# EAGLE design fanCtrl (EAGLE 9.4.1)
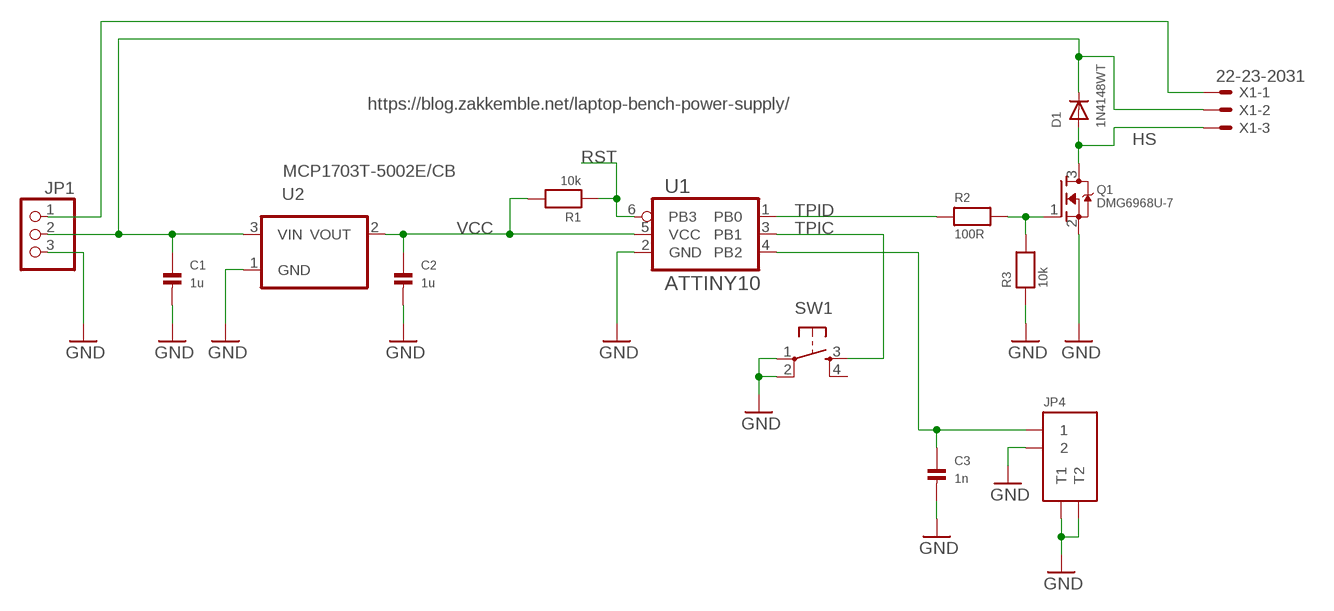
[diagram p0: schematic, sheet 1]

## Parts
C1  1u  CAP_CERAMIC_0603MP  [_0603MP]
C2  1u  CAP_CERAMIC_0603MP  [_0603MP]
C3  1n  CAP_CERAMIC0402_SMALL  [0402_SMALL]
D1  1N4148WT  DIODESOD-523  [SOD-523]
JP1  PINHD-1X3  [1X03]
JP4  2WAY  [2WAY]
Q1  DMG6968U-7  MOSFET-NWAVE  [SOT23-W]
R1  10k  RESISTOR0402_SMALL  [0402_SMALL]
R2  100R  RESISTOR0402_SMALL  [0402_SMALL]
R3  10k  RESISTOR0402_SMALL  [0402_SMALL]
SW1  SPST_TACTG75_3X4  [TACT_SMD5]
U1  ATTINY10  ATTINY10SM_PAD  [SOT23-6_SM_PAD]
U2  MCP1703T-5002E/CB  MCP1700T-2502E/TTWIDE_PAD  [SOT-23]
X1  22-23-2031  [22-23-2031]

## Nets
GND: C1.2 C2.2 C3.2 JP1.3 JP4.P$2 JP4.TAB$1(T1) JP4.TAB$2(T2) Q1.2(S) R3.1 SW1.1(P) SW1.2(P1) U1.2(GND) U2.1(GND)
HS: D1.A Q1.3(D) X1.3
N$1: Q1.1(G) R2.2 R3.2
N$4: C3.1 JP4.P$1 U1.4(PB2)
N$7: C1.1 D1.K(C) JP1.2 U2.3(VIN) X1.2
N$10: JP1.1 X1.1
RST: R1.1 U1.6(PB3)
TPIC: SW1.3(S) U1.3(PB1)
TPID: R2.1 U1.1(PB0)
VCC: C2.1 R1.2 U1.5(VCC) U2.2(VOUT)
Unconnected: SW1.4(S1)

## Notes on the sheet
- https://blog.zakkemble.net/laptop-bench-power-supply/

## Library data of the parts
C1 C2 = microbuilder:CAP_CERAMIC: Ceramic Capacitors 0402 - 0402 Surface Mount Capacitors 16pF 50V 5% [Digikey: 445-4899-2-ND] 18pF 50V 5% [Digikey: 490-1281-2-ND] 22pF 50V 5% [Digikey: 490-1283-2-ND] 68pF 50V 5% [Digikey: 490-1289-2-ND] 0.1uF 10V 10% [Digikey: 490-1318-2-ND] 1.0uF 6.3V 10% [Digikey: 490-1320-2-ND] 0603 - 0603 Surface Mount Capacitors 16 pF 50V 5% [Digikey: 445-5051-2-ND] 22 pF 50V [Digikey: PCC220ACVTR-ND] 33 pF 50V 5% [Digikey: 490-1415-1-ND] 56pF 50V 5% [Digikey: 490-1421-1-ND] 220pF 50V 5% [Digikey: 445-1285-1-ND] 680 pF 50V 2200 pF 50V 5% C0G [Digikey: 445-1297-1-ND] 5600 pF 100V 5% X7R [Digikey: 478-3711-1-ND] 0.1 µF 25V 10% [Digikey: PCC2277TR-ND] 0.22 µF 16V 10% X7R [Digikey: 445-1318-1-ND] 1.0 µF 25V 10% [Digikey: 445-5146-2-ND] 0603 - RF Specific 3pF 250V +/-0.1pF RF [Digikey: 712-1347-1-ND] 18 pF 250V 5% [Digikey: 478-3505-1-ND or 712-1322-1-ND] 56 pF 250V 5% C0G RF [Digikey: 490-4867-1-ND] 68 pF 250V RF [Digikey: 490-4868-1-ND] 0805 - 0805 Surface Mount Capacitors 220 pF 250V 2% RF Ceramic Capacitor [Digikey: 712-1398-1-ND] 1000 pF 50V 2% NP0 Ceramic Capacitor [Digikey: 478-3760-1-ND] 0.1 µF 25V 10% Ceramic Capacitor [Digikey: PCC1828TR-ND] 1.0 µF 16V 10% Ceramic Capacitor[Digikey: 490-1691-2-ND] 10.0 µF 10V 10% Ceramic Capacitor[Digikey: 709-1228-1-ND] 10.0 uF 16V 10% Ceramic Capacitor [Digikey: 478-5165-2-ND] 47 uF 6.3V 20% Ceramic Capacitor [Digikey: 587-1779-1-ND or 399-5506-1-ND] 1206 - 1206 Surface Mount Capacitors 47uF 10V 20% Ceramic Capacitor [Digikey: 490-5528-1-ND or 399-5508-1-ND or 445-6010-1-ND] 100uF 6.3V -20%, +80% Y5V Ceramic Capacitor (Digikey: 490-4512-1-ND, Mouser: 81-GRM31CF50J107ZE1L)
C3 = zak:CAP_CERAMIC
D1 = zak:DIODE: Diode in 0805 package
JP1 = pinhead:PINHD-1X3: PIN HEADER
JP4 = zak-jst-sh:2WAY
Q1 = microbuilder:MOSFET-N: N-Channel Mosfet LEGEND VDS: Voltage Drain-Source ID: Drain Current RDS(ON): Drain-Source On-State Resistance VGS(TH): Gate-Source Threshold Voltage CISS: Drain-Source Input Capacitance SOT-23 Name VDS ID RDS(ON) VGS(TH) CISS Order Number 2N7002E 60V 260mA 2.5 Ohm 2.5V @ 250uA 26.7pF @ 25V 2N7002ET1GOSTR-ND BSH103 30V 850mA 400 mOhm 400mV @ 1mA 83pF @ 24V BSH103,235-ND BSS138 60V 320mA 1.6 Ohm 1.5V @ 250uA 50pF @ 10V Mouser: 771-BSS138PW115 DMN2075U-7 20V 4.2A 38 mOhm 1V @ 250 uA 594.3pF @ 10V DMN2075U-7DICT-ND * BSS138 good choice for I2C level-shifting
R1-R3 = zak:RESISTOR
SW1 = zak:SPST_TACT
U1 = zak:ATTINY10
U2 = zak:MCP1700T-2502E/TT: Low Quiescent Current LDO
X1 = con-molex:22-23-2031: .100" (2.54mm) Center Header - 3 Pin; MF: MOLEX; MPN: 22-23-2031; OC_FARNELL: 1462950; OC_NEWARK: 30C0862

## Board
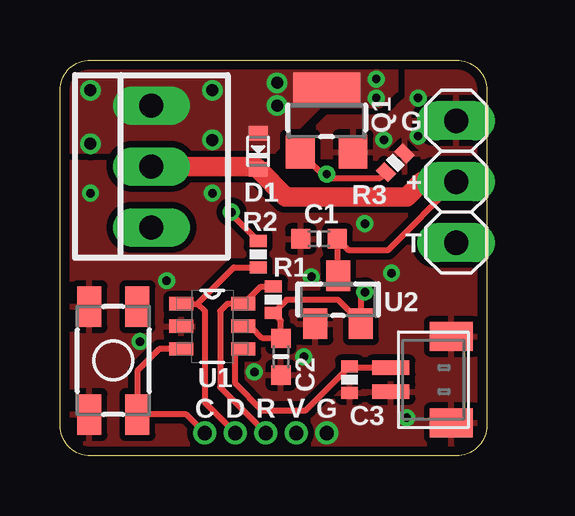
[diagram p1: board, top side]
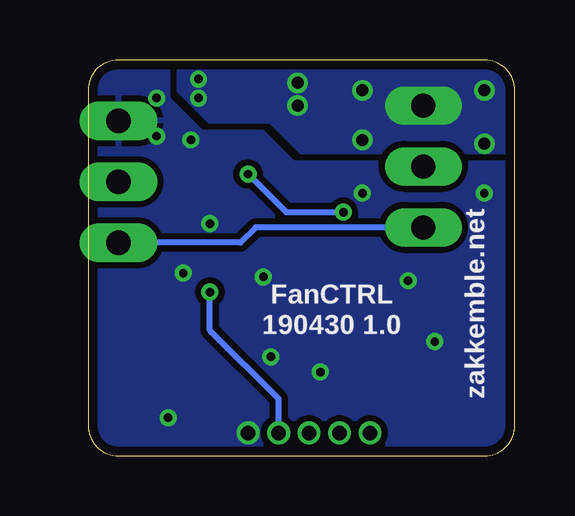
[diagram p2: board, bottom side, seen from below]

Size 17.78 x 16.51 mm. Coordinates in mm from the lower left corner, seen from the top.
Outline: 0,15.24 arc-90 1.27,16.51 16.51,16.51 arc-90 17.78,15.24 17.78,1.27 arc-90 16.51,0 1.27,0 arc-90 0,1.27 0,15.24
Copper layers (1*16): Top 0.0356mm / dielectric 1.5011mm / Bottom 0.0356mm
Design rules "LaenPCBOrder *": minimum track width 6mil, minimum drill 13mil, track to track 6mil, track to pad 6mil, pad to pad 6mil, via to via 6mil, smd to smd 6mil, copper to edge 15mil, drill to drill 6mil, minimum pad ring 12mil, minimum via ring 7mil, stop-mask expansion 4mil, vias tented up to drill 23mil, thermal gap 10mil

### Footprints (pad centres in the part's own frame; a part is rotated, then mirrored left to right if it is on the bottom)
_0603MP = smd 0.8 x 0.8: 1 -0.762,0; 2 0.762,0
0402_SMALL = smd 0.5 x 0.7: 1 -0.55,0; 2 0.55,0
SOD-523 = smd 0.8 x 0.6: A 0,-0.75; K 0,0.75
1X03 = drill 1.016 long: 1 -2.54,0; 2 0,0; 3 2.54,0
2WAY = smd 0.6 x 1.55: P$1 -0.5,-1.775; P$2 0.5,-1.775 | smd 1.2 x 1.8: TAB$1 -1.8,0.75; TAB$2 1.8,0.75
SOT23-W = smd 1.2 x 1.4: 1 -1.1,-1.3; 2 1.1,-1.3 | smd 2.8 x 1.4: 3 0,1.3
TACT_SMD5 = smd 1.7 x 1: 1 -2.25,1; 2 2.25,1; 3 -2.25,-1; 4 2.25,-1
SOT23-6_SM_PAD = smd 1 x 0.56: 1 -1.295,0.94; 2 -1.295,0; 3 -1.295,-0.94; 4 1.295,-0.94; 5 1.295,0; 6 1.295,0.94
SOT-23 = smd 1 x 1.27: 1 -0.95,-1; 2 0.95,-1; 3 0,1
22-23-2031 = drill 1 long: 1 -2.54,0; 2 0,0; 3 2.54,0

### Placement (x,y rotation side)
C1  10.79,9.05 180 top
C2  9.21,4.13 270 top
C3  12.06,3.18 270 top
D1  8.25,12.7 180 top
JP1  16.51,11.43 90 top
JP4  15.56,3.18 270 top
Q1  11.11,13.97 0 top
R1  8.89,6.51 270 top
R2  8.25,8.41 90 top
R3  13.97,12.22 225 top
SW1  2.22,3.97 90 top
U1  6.35,5.4 0 top
U2  11.59,6.51 0 top
X1  3.81,12.06 90 top

### Tracks (layer width: path | path; a pad name or v marks a point on that pad's centre or on a via)
GND  (via drill 0.35, 0.6)
  other vias: 14.45,1.59 11.11,0.95 10.16,4.13 8.1,3.49 3.33,4.76 4.45,7.3 13.81,7.62 10.48,7.46 6.35,10.95 1.27,10.95 12.7,9.68 13.49,13.18 14.92,14.92 14.92,13.33
  pour Top (isolate 0.254, rank 6): 0,16.51 17.78,16.51 17.78,0 0,0
  pour Bottom (isolate 0.254, rank 6): 17.78,16.51 0,16.51 0,0 17.78,0
HS  (via drill 0.35, 0.5)
  other vias: 9.05,15.56 13.18,15.72 6.35,15.24 1.27,15.24 1.27,13.02 6.35,13.18 13.18,14.92 9.05,14.6
  pour Bottom (isolate 0.254, rank 5, no thermals): 13.97,16.51 13.97,15.24 12.7,13.97 10.16,13.97 8.89,12.7 0,12.7 0,16.51
  pour Top (isolate 0.254, rank 5, no thermals): 0,16.51 13.97,16.51 13.97,15.24 13.33,14.6 10.79,14.6 8.89,12.7 0,12.7
N$1  (via drill 0.35)
  Top 0.254: Q1.1 10.93,11.75 v11.11,11.75 11.27,11.59 13.33,11.59 R3.2 | R2.2 7.14,10.07 v7.14,10.16
  Bottom 0.254: v7.14,10.16 9.53,10.16 v11.11,11.75
N$4
  Top 0.254: U1.4 7.3,4.46 7.3,3.02 8.41,1.91 10.24,1.91 C3.1 12.12,3.68 JP4.P$1
N$7
  Top 0.254: 11.46,7.64 U2.3 11.56,7.54 C1.1 12.03,8.57 13.65,8.57 JP1.2
  Top 0.813: JP1.2 15.08,11.43 14.45,10.79 9.41,10.79 D1.K 8.14,12.06 X1.2
N$10
  Bottom 0.254: X1.1 10.79,9.53 11.43,8.89 JP1.1
RST  (via drill 0.6)
  Top 0.254: v8.57,0.95 6.67,2.86 6.67,6.03 6.97,6.34 U1.6 8.37,7.06 R1.1
TPIC  (via drill 0.6)
  Top 0.254: U1.3 4.14,4.46 3.22,3.54 SW1.3 5.27,1.72 v6.03,0.95
TPID  (via drill 0.6)
  Top 0.254: v7.3,0.95 6.03,2.22 6.03,6.03 5.73,6.34 5.71,6.34 | U1.1 5.71,6.34 | R2.1 7.24,7.86 5.71,6.34
VCC  (via drill 0.35, 0.6)
  Top 0.254: U2.2 12.54,5.56 | 12.54,5.56 11.59,6.51 9.44,6.51 R1.2 9.21,5.64 C2.1 9.18,4.92 8.41,4.92 7.94,5.4 U1.5 | v12.7,6.83 12.54,6.66 12.54,5.56
  Bottom 0.254: v9.84,0.95 9.84,2.38 12.7,5.24 v12.7,6.83

### Text on the board
tPlace: G | + | T | C | D | R | V | G
bPlace: zakkemble.net | FanCTRL | 190430 1.0